# Altium project BRGTC6_Dual_Daughter.PrjPcb
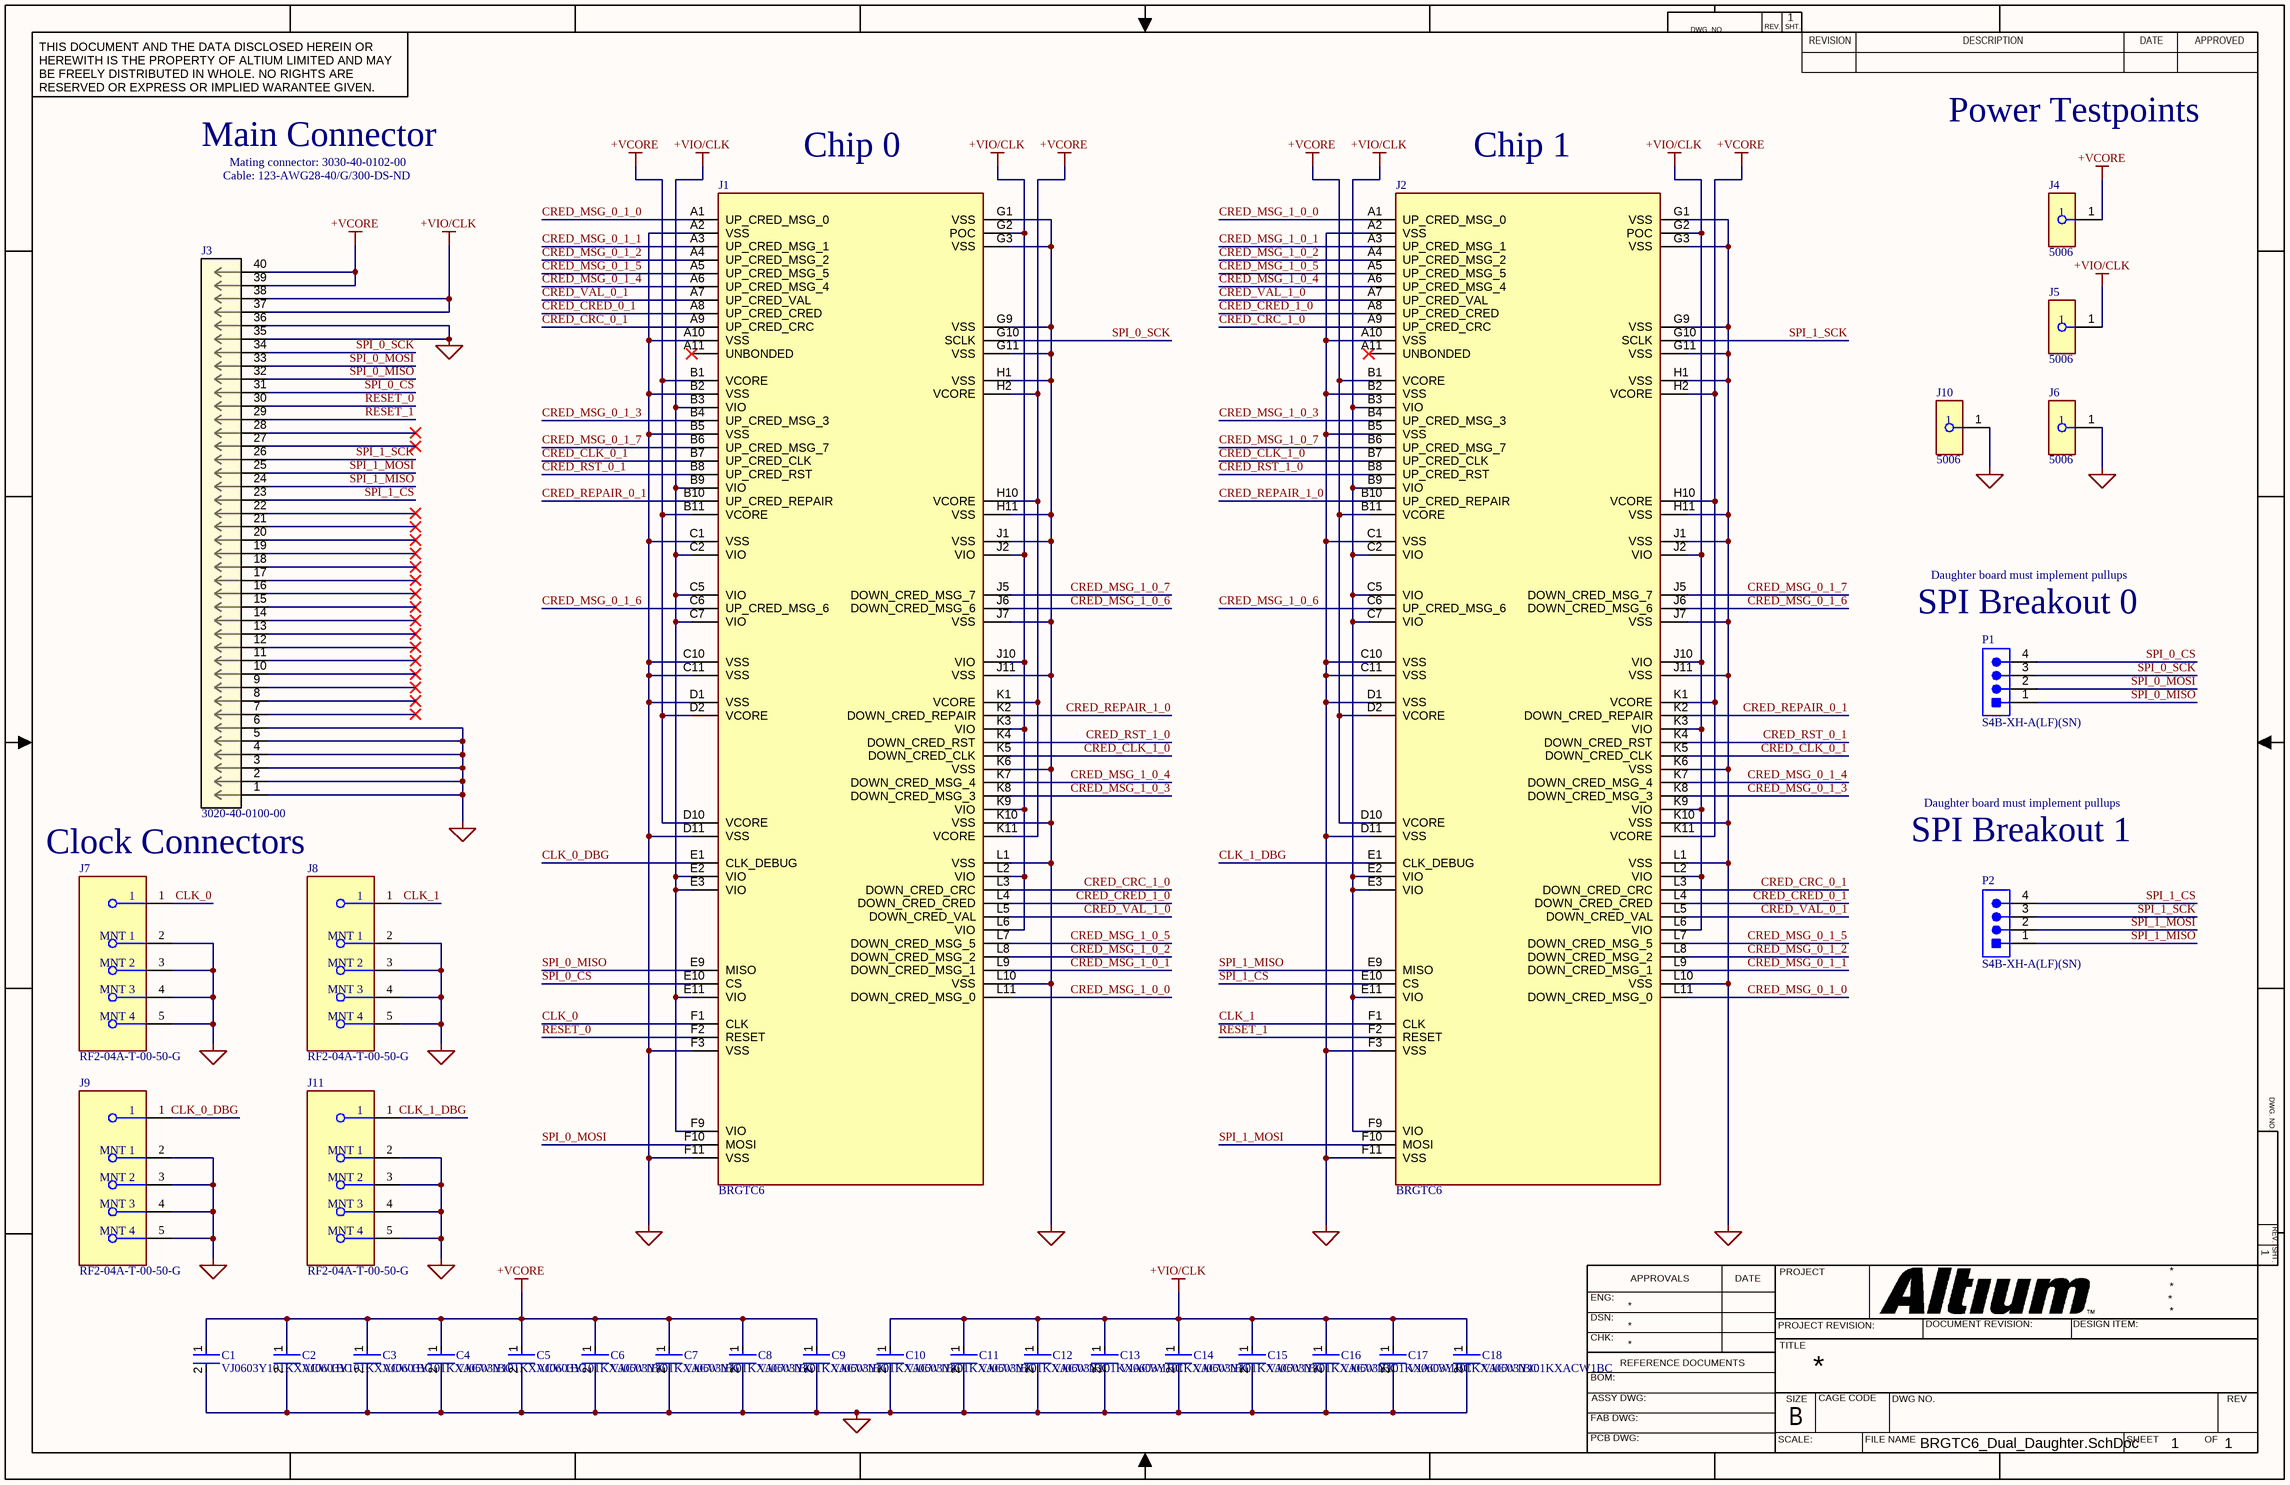
[diagram p0: BRGTC6_Dual_Daughter.SchDoc]
1 sheet, 31 parts. Net scope: global (net labels, ports and power ports of the same name join across sheets).
Board file: BRGTC6_Dual_Daughter.PcbDoc

## Sheet BRGTC6_Dual_Daughter.SchDoc
size 431 x 279 mm; SheetNumber: 1; SheetTotal: 1

### Parts
C1  VJ0603Y101KXACW1BC  [FP-CC0603-DA-MFG]
C2  VJ0603Y101KXACW1BC  [FP-CC0603-DA-MFG]
C3  VJ0603Y101KXACW1BC  [FP-CC0603-DA-MFG]
C4  VJ0603Y101KXACW1BC  [FP-CC0603-DA-MFG]
C5  VJ0603Y101KXACW1BC  [FP-CC0603-DA-MFG]
C6  VJ0603Y101KXACW1BC  [FP-CC0603-DA-MFG]
C7  VJ0603Y101KXACW1BC  [FP-CC0603-DA-MFG]
C8  VJ0603Y101KXACW1BC  [FP-CC0603-DA-MFG]
C9  VJ0603Y101KXACW1BC  [FP-CC0603-DA-MFG]
C10  VJ0603Y101KXACW1BC  [FP-CC0603-DA-MFG]
C11  VJ0603Y101KXACW1BC  [FP-CC0603-DA-MFG]
C12  VJ0603Y101KXACW1BC  [FP-CC0603-DA-MFG]
C13  VJ0603Y101KXACW1BC  [FP-CC0603-DA-MFG]
C14  VJ0603Y101KXACW1BC  [FP-CC0603-DA-MFG]
C15  VJ0603Y101KXACW1BC  [FP-CC0603-DA-MFG]
C16  VJ0603Y101KXACW1BC  [FP-CC0603-DA-MFG]
C17  VJ0603Y101KXACW1BC  [FP-CC0603-DA-MFG]
C18  VJ0603Y101KXACW1BC  [FP-CC0603-DA-MFG]
J1  BRGTC6  [3M_200-6311-9UN-1900]
J2  BRGTC6  [3M_200-6311-9UN-1900]
J3  3020-40-0100-00  [CONN_3020-40-0100-00_CNC]
J4  5006  [FP-5006-MFG]
J5  5006  [FP-5006-MFG]
J6  5006  [FP-5006-MFG]
J7  RF2-04A-T-00-50-G  [FP-RF2-04A-T-00-50-G-MFG]
J8  RF2-04A-T-00-50-G  [FP-RF2-04A-T-00-50-G-MFG]
J9  RF2-04A-T-00-50-G  [FP-RF2-04A-T-00-50-G-MFG]
J10  5006  [FP-5006-MFG]
J11  RF2-04A-T-00-50-G  [FP-RF2-04A-T-00-50-G-MFG]
P1  S4B-XH-A(LF)(SN)  [JST-S4B-XH-A(LF)(SN)_V]
P2  S4B-XH-A(LF)(SN)  [JST-S4B-XH-A(LF)(SN)_V]

### Nets
+VCORE: C1.1 C2.1 C3.1 C4.1 C5.1 C6.1 C7.1 C8.1 C9.1 J1.B1(VCORE) J1.B11(VCORE) J1.D2(VCORE) J1.D10(VCORE) J1.H2(VCORE) J1.H10(VCORE) J1.K1(VCORE) J1.K11(VCORE) J2.B1(VCORE) J2.B11(VCORE) J2.D2(VCORE) J2.D10(VCORE) J2.H2(VCORE) J2.H10(VCORE) J2.K1(VCORE) J2.K11(VCORE) J3.39 J3.40 J4.1
+VIO/CLK: C10.1 C11.1 C12.1 C13.1 C14.1 C15.1 C16.1 C17.1 C18.1 J1.B3(VIO) J1.B9(VIO) J1.C2(VIO) J1.C5(VIO) J1.C7(VIO) J1.E2(VIO) J1.E3(VIO) J1.E11(VIO) J1.F9(VIO) J1.G2(POC) J1.J2(VIO) J1.J10(VIO) J1.K3(VIO) J1.K9(VIO) J1.L2(VIO) J1.L6(VIO) J2.B3(VIO) J2.B9(VIO) J2.C2(VIO) J2.C5(VIO) J2.C7(VIO) J2.E2(VIO) J2.E3(VIO) J2.E11(VIO) J2.F9(VIO) J2.G2(POC) J2.J2(VIO) J2.J10(VIO) J2.K3(VIO) J2.K9(VIO) J2.L2(VIO) J2.L6(VIO) J3.37 J3.38 J5.1
GND: C1.2 C2.2 C3.2 C4.2 C5.2 C6.2 C7.2 C8.2 C9.2 C10.2 C11.2 C12.2 C13.2 C14.2 C15.2 C16.2 C17.2 C18.2 J1.A2(VSS) J1.A10(VSS) J1.B2(VSS) J1.B5(VSS) J1.C1(VSS) J1.C10(VSS) J1.C11(VSS) J1.D1(VSS) J1.D11(VSS) J1.F3(VSS) J1.F11(VSS) J1.G1(VSS) J1.G3(VSS) J1.G9(VSS) J1.G11(VSS) J1.H1(VSS) J1.H11(VSS) J1.J1(VSS) J1.J7(VSS) J1.J11(VSS) J1.K6(VSS) J1.K10(VSS) J1.L1(VSS) J1.L10(VSS) J2.A2(VSS) J2.A10(VSS) J2.B2(VSS) J2.B5(VSS) J2.C1(VSS) J2.C10(VSS) J2.C11(VSS) J2.D1(VSS) J2.D11(VSS) J2.F3(VSS) J2.F11(VSS) J2.G1(VSS) J2.G3(VSS) J2.G9(VSS) J2.G11(VSS) J2.H1(VSS) J2.H11(VSS) J2.J1(VSS) J2.J7(VSS) J2.J11(VSS) J2.K6(VSS) J2.K10(VSS) J2.L1(VSS) J2.L10(VSS) J3.1 J3.2 J3.3 J3.4 J3.5 J3.6 J3.35 J3.36 J6.1 J7.2(MNT_1) J7.3(MNT_2) J7.4(MNT_3) J7.5(MNT_4) J8.2(MNT_1) J8.3(MNT_2) J8.4(MNT_3) J8.5(MNT_4) J9.2(MNT_1) J9.3(MNT_2) J9.4(MNT_3) J9.5(MNT_4) J10.1 J11.2(MNT_1) J11.3(MNT_2) J11.4(MNT_3) J11.5(MNT_4)
CLK_0: J1.F1(CLK) J7.1
CLK_0_DBG: J1.E1(CLK_DEBUG) J9.1
CLK_1: J2.F1(CLK) J8.1
CLK_1_DBG: J2.E1(CLK_DEBUG) J11.1
CRED_CLK_0_1: J1.B7(UP_CRED_CLK) J2.K5(DOWN_CRED_CLK)
CRED_CLK_1_0: J1.K5(DOWN_CRED_CLK) J2.B7(UP_CRED_CLK)
CRED_CRC_0_1: J1.A9(UP_CRED_CRC) J2.L3(DOWN_CRED_CRC)
CRED_CRC_1_0: J1.L3(DOWN_CRED_CRC) J2.A9(UP_CRED_CRC)
CRED_CRED_0_1: J1.A8(UP_CRED_CRED) J2.L4(DOWN_CRED_CRED)
CRED_CRED_1_0: J1.L4(DOWN_CRED_CRED) J2.A8(UP_CRED_CRED)
CRED_MSG_0_1_0: J1.A1(UP_CRED_MSG_0) J2.L11(DOWN_CRED_MSG_0)
CRED_MSG_0_1_1: J1.A3(UP_CRED_MSG_1) J2.L9(DOWN_CRED_MSG_1)
CRED_MSG_0_1_2: J1.A4(UP_CRED_MSG_2) J2.L8(DOWN_CRED_MSG_2)
CRED_MSG_0_1_3: J1.B4(UP_CRED_MSG_3) J2.K8(DOWN_CRED_MSG_3)
CRED_MSG_0_1_4: J1.A6(UP_CRED_MSG_4) J2.K7(DOWN_CRED_MSG_4)
CRED_MSG_0_1_5: J1.A5(UP_CRED_MSG_5) J2.L7(DOWN_CRED_MSG_5)
CRED_MSG_0_1_6: J1.C6(UP_CRED_MSG_6) J2.J6(DOWN_CRED_MSG_6)
CRED_MSG_0_1_7: J1.B6(UP_CRED_MSG_7) J2.J5(DOWN_CRED_MSG_7)
CRED_MSG_1_0_0: J1.L11(DOWN_CRED_MSG_0) J2.A1(UP_CRED_MSG_0)
CRED_MSG_1_0_1: J1.L9(DOWN_CRED_MSG_1) J2.A3(UP_CRED_MSG_1)
CRED_MSG_1_0_2: J1.L8(DOWN_CRED_MSG_2) J2.A4(UP_CRED_MSG_2)
CRED_MSG_1_0_3: J1.K8(DOWN_CRED_MSG_3) J2.B4(UP_CRED_MSG_3)
CRED_MSG_1_0_4: J1.K7(DOWN_CRED_MSG_4) J2.A6(UP_CRED_MSG_4)
CRED_MSG_1_0_5: J1.L7(DOWN_CRED_MSG_5) J2.A5(UP_CRED_MSG_5)
CRED_MSG_1_0_6: J1.J6(DOWN_CRED_MSG_6) J2.C6(UP_CRED_MSG_6)
CRED_MSG_1_0_7: J1.J5(DOWN_CRED_MSG_7) J2.B6(UP_CRED_MSG_7)
CRED_REPAIR_0_1: J1.B10(UP_CRED_REPAIR) J2.K2(DOWN_CRED_REPAIR)
CRED_REPAIR_1_0: J1.K2(DOWN_CRED_REPAIR) J2.B10(UP_CRED_REPAIR)
CRED_RST_0_1: J1.B8(UP_CRED_RST) J2.K4(DOWN_CRED_RST)
CRED_RST_1_0: J1.K4(DOWN_CRED_RST) J2.B8(UP_CRED_RST)
CRED_VAL_0_1: J1.A7(UP_CRED_VAL) J2.L5(DOWN_CRED_VAL)
CRED_VAL_1_0: J1.L5(DOWN_CRED_VAL) J2.A7(UP_CRED_VAL)
RESET_0: J1.F2(RESET) J3.30
RESET_1: J2.F2(RESET) J3.29
SPI_0_CS: J1.E10(CS) J3.31 P1.4
SPI_0_MISO: J1.E9(MISO) J3.32 P1.1
SPI_0_MOSI: J1.F10(MOSI) J3.33 P1.2
SPI_0_SCK: J1.G10(SCLK) J3.34 P1.3
SPI_1_CS: J2.E10(CS) J3.23 P2.4
SPI_1_MISO: J2.E9(MISO) J3.24 P2.1
SPI_1_MOSI: J2.F10(MOSI) J3.25 P2.2
SPI_1_SCK: J2.G10(SCLK) J3.26 P2.3

Not connected (* = marked no-connect by the designer): J1 A11(UNBONDED)*; J2 A11(UNBONDED)*; J3 7* 8* 9* 10* 11* 12* 13* 14* 15* 16* 17* 18* 19* 20* 21* 22* 27* 28*

### Notes on the sheet
- Main Connector
- Mating connector: 3030-40-0102-00
- Chip 0
- Chip 1
- Power Testpoints
- Cable: 123-AWG28-40/G/300-DS-ND
- (near P1) SPI Breakout 0
- Daughter board must implement pullups
- Clock Connectors
- (near P2) SPI Breakout 1
- DWG. NO.
- REV.
- SHT.
- THIS DOCUMENT AND THE DATA DISCLOSED HEREIN OR HEREWITH IS THE PROPERTY OF ALTIUM LIMITED AND MAY BE FREELY DISTRIBUTED IN WHOLE. NO RIGHTS ARE RESERVED OR EXPRESS OR IMPLIED WARANTEE GIVEN.
- REVISION
- DESCRIPTION
- DATE
- APPROVED
- ENG:
- APPROVALS
- PROJECT
- DSN:
- CHK:
- REFERENCE DOCUMENTS
- PROJECT REVISION:
- TITLE
- DOCUMENT REVISION:
- DESIGN ITEM:
- BOM:
- FAB DWG:
- PCB DWG:
- ASSY DWG:
- SCALE:
- SIZE
- B
- CAGE CODE
- FILE NAME
- DWG NO.
- SHEET
- OF
- REV

### Library data of the parts
C1-C18 = CMP-2000-05002-2: CAP CER 0.1UF 16V X7R 0603; Manufacturer Part Number: CC0603KRX7R7BB104; Manufacturer: YAGEO; Tolerance: 0.1; Value: 100 nF; Temperature Coefficient: 15%; Material: Ceramic; Voltage Rating: 16 V; Package: CC0603-DA; ComponentLink2Description: Datasheet; Octopart: https://octopart.com/cc0603krx7r7bb104-yageo-192941; Temperature Range High: +125°C; Digikey Description: CAP CER 0.1UF 16V X7R 0603; Voltage: 16 V; Device Class L2: Capacitors; Height: 0.9mm; Temperature: -55°C to +125°C; Device Class L1: Passive Components; Device Class L3: Ceramic Capacitors; ComponentLink2URL: http://www.yageo.com/documents/recent/UPY-GPHC_X7R_6.3V-to-50V_18.pdf; Footprint Url: http://www.yageo.com/exep/pages/download/literatures/UPY-C_GEN_24.pdf; RoHS: TRUE; Temperature Range Low: -55°C; Temperature Characteristic: X7R; Lead Free: Yes; Capacitance: 100 nF; Category: Cap; Mouser Description: Multilayer Ceramic Capacitor, CC Series, 0.1 - F, - 10%, X7R, 16 V, 0603 [1608 Metric]; Automotive: No
J1 J2 = 200-6311-9UN-1900: 121 _11 x 11_ Pos PGA, ZIF _ZIP_ Socket Gold Through Hole; MF: 3M; SnapEDA_Link: https://www.snapeda.com/parts/200-6311-9UN-1900/3M%20_TC_/view-part/159310/?ref=snap; Digi-Key_Part_Number: 3M5067-ND; MP: 200-6311-9UN-1900; Package: None; Digi-Key_Purchase_URL: https://www.digikey.com/product-detail/en/3m/200-6311-9UN-1900/3M5067-ND/1130121?utm_source=snapeda&utm_medium=aggregator&utm_campaign=symbol; Value: *
J3 = 3020-40-0100-00: No Description Available; Mfr_Name: CNC Tech; RefDes: RefDes; Type: Type
J4-J6 J10 = CMP-19636-000022-1: PC TEST POINT COMPACT BLACK; Body Material: Bronze; Inside Diameter: 1.78mm; Number of Ports: 1; Hole Diameter: 1.6mm; Outside Diameter: 3.18mm; Plating: Silver; Contact Plating: Tin; Color: Black; RoHS Compliant: Yes; Flammability Rating: UL94 V-0; Contact Material: Bronze; Material: Nylon; Orientation: Straight; Package Quantity: 100; Housing Color: Black; Length: 8.89mm; Series: THM; Mount: PCB; Height: 0.35inch; Packaging: Bulk; REACH SVHC: No SVHC; Insulation Material: Nylon; Lead Free: Lead Free
J7-J9 J11 = CMP-42753-000002-1: CONN SMA JACK STR 50 OHM PCB
P1 P2 = CMP-1755-00007-1: Male Header, Pitch 2.5 mm, 1 x 4 Position, Height 6.1 mm, Tail Length 3.4 mm, -25 to 85 degC, RoHS, Bulk; PackageReference: S4B-XH-A(LF)(SN); ComponentLink1Description: Manufacturer URL; DatasheetVersion: May-16; ComponentLink2Description: Datasheet; ComponentLink2URL: http://www.jst-mfg.com/product/pdf/eng/eXH.pdf; ComponentLink1URL: http://www.jst.com/home2.html; PackageDescription: Male Header, Pitch 2.5 mm, 1 x 4 Position, Height 6.1 mm, Tail Length 3.4 mm